# Altium schematic sheet Hexa.SchDoc: Title
size 594 x 420 mm; CompanyName: Лаборатория беспилотных систем; Address1: Address1; Address2: Address2; Address3: Address3; Address4: Address4; DocumentNumber: АБВГ.123456.001 Э3; SheetNumber: 1; SheetTotal: 2; Scale: -; DocumentType: Схема электрическая принципиальная; FirstReferrence: АБВГ.123456.001
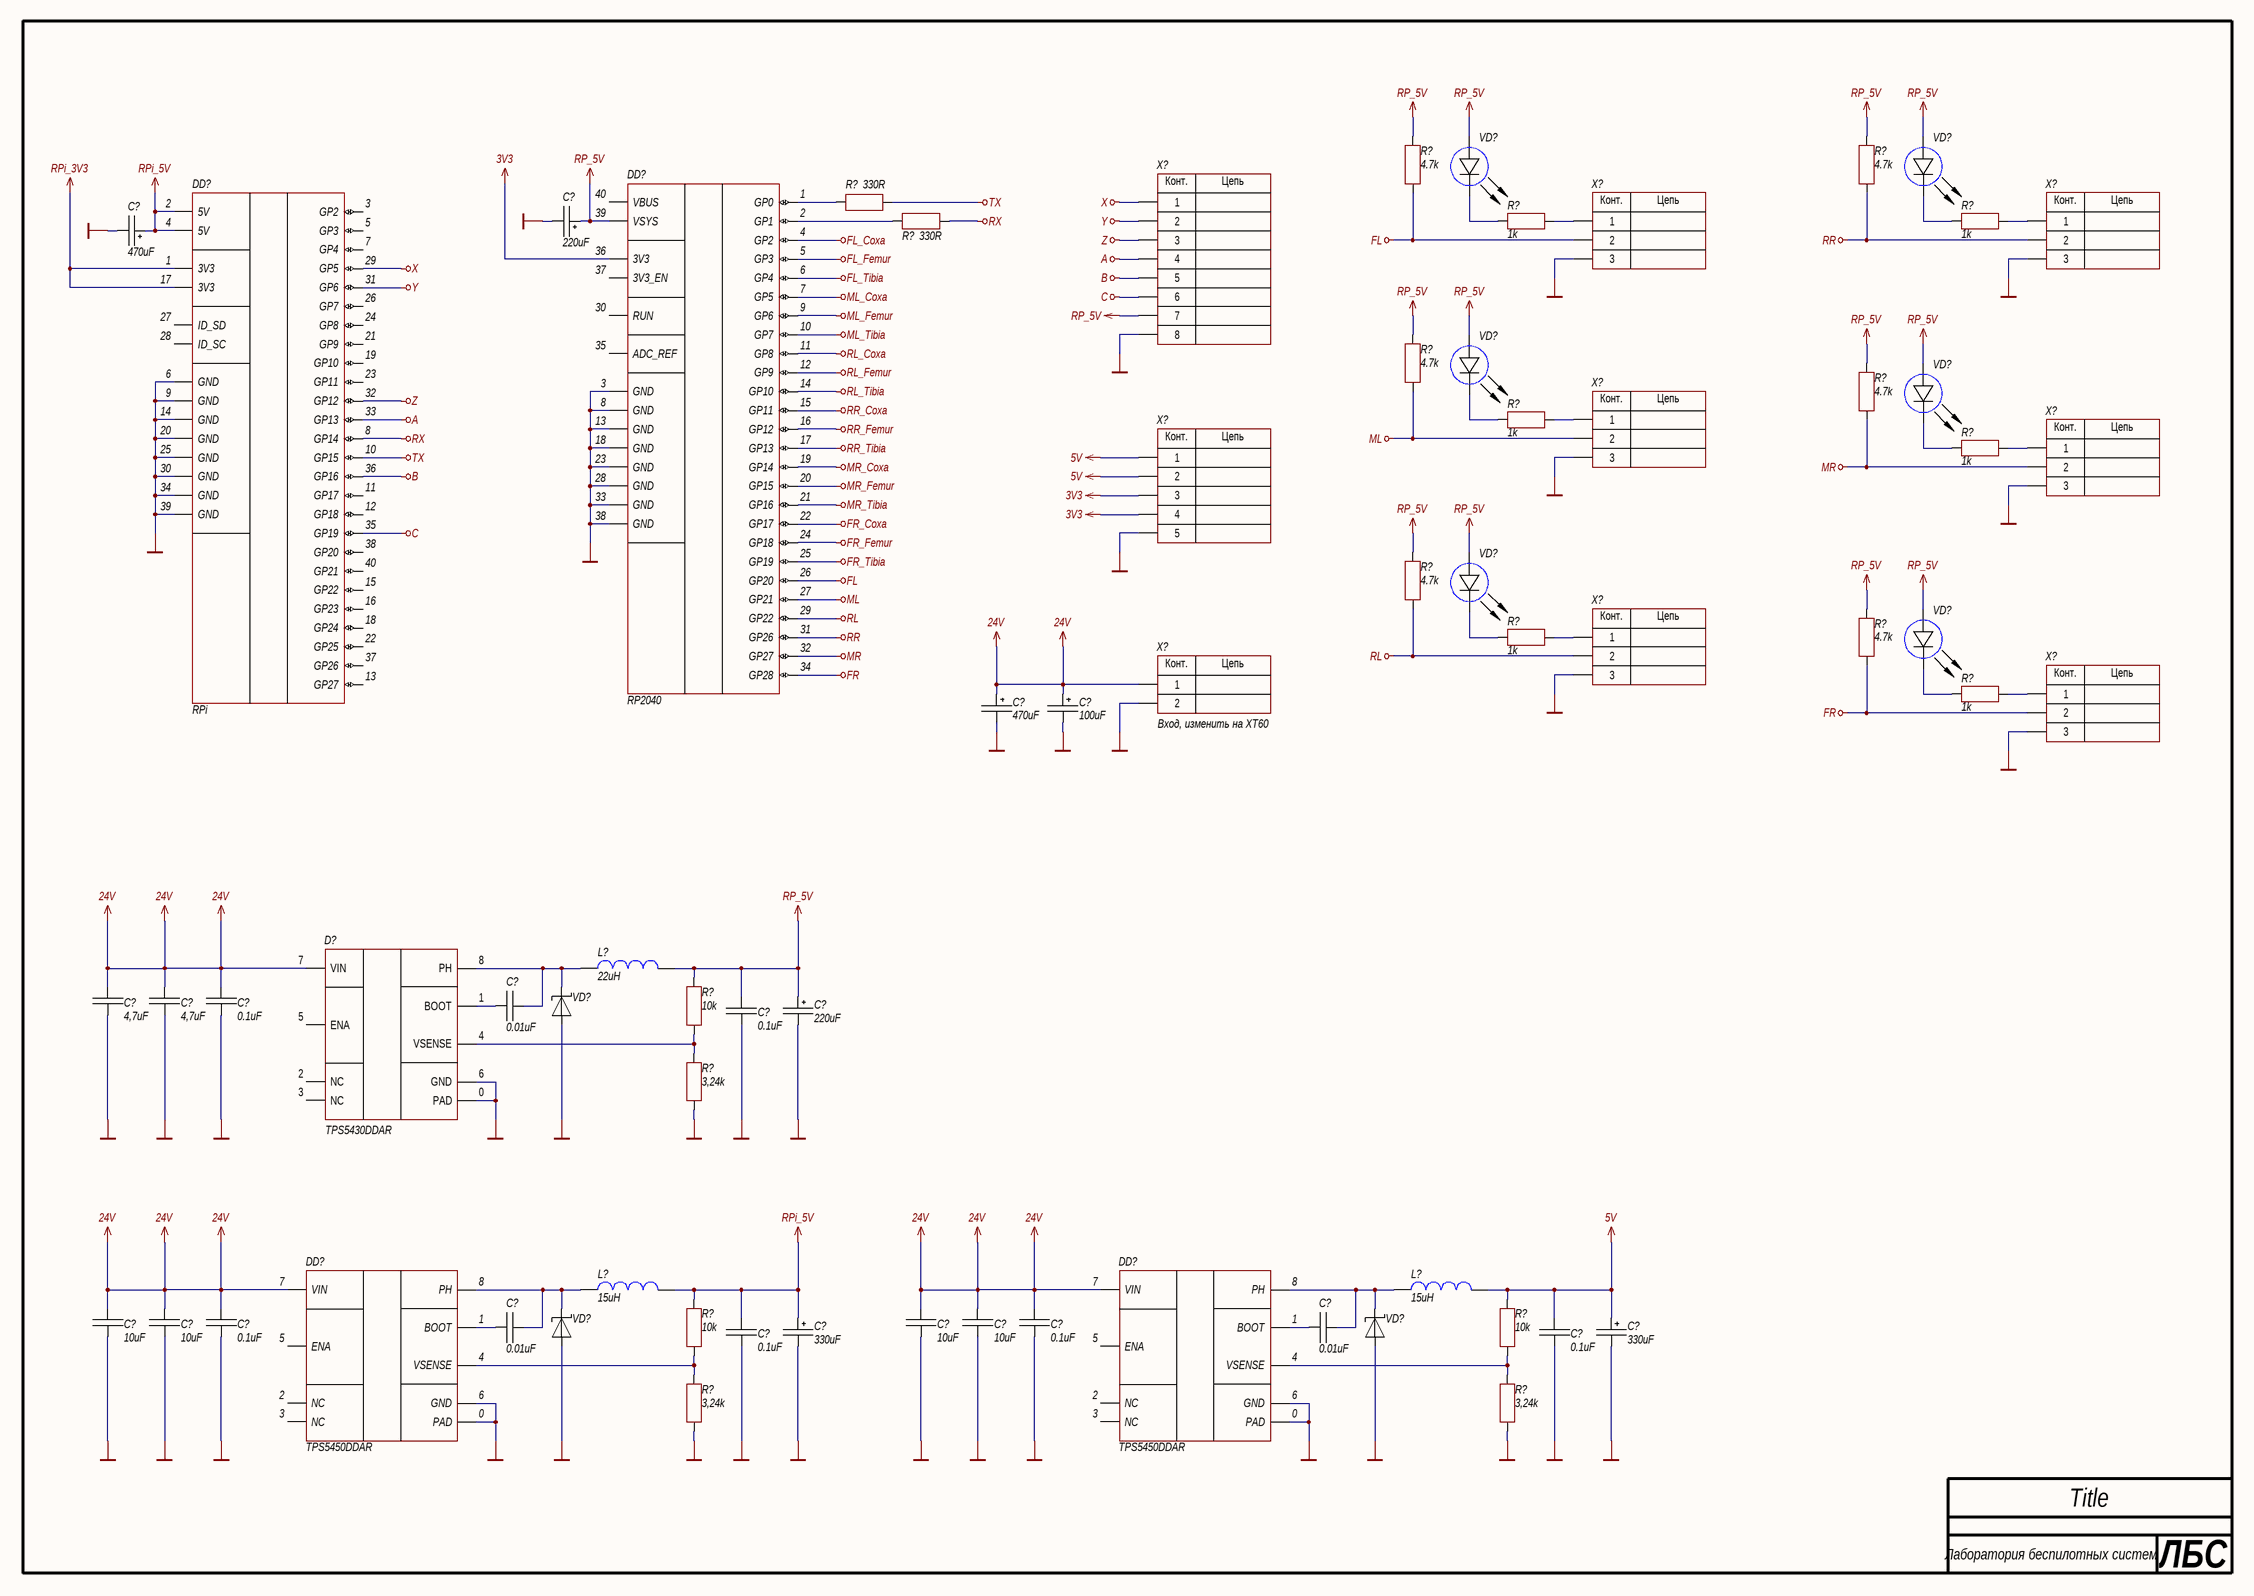
[diagram p0: Hexa.SchDoc]

## Parts
(Parts that share a designator on the sheet are numbered #1, #2 ... from top to bottom, then left to right.)
C?#1  value 220uF  [CAP: SMD_L7.3-W4.3-H1.9]
C?#2  value 470uF  [CAP: SMD_L7.3-W4.3-H1.9]
C?#3  value 470uF  [CAP: SMD_L7.3-W4.3-H1.9]
C?#4  value 100uF  [CAP: SMD_L7.3-W4.3-H1.9]
C?#5  value 4,7uF  [CAP: 1206]
C?#6  value 4,7uF  [CAP: 1206]
C?#7  value 0.1uF  [CAP: 0603]
C?#8  value 220uF  [CAP: SMD_L7.3-W4.3-H1.9]
C?#9  value 0.01uF  [CAP: 0603]
C?#10  value 0.1uF  [CAP: 0603]
C?#11  value 10uF  [CAP: 1206]
C?#12  value 10uF  [CAP: 1206]
C?#13  value 0.1uF  [CAP: 0603]
C?#14  value 10uF  [CAP: 1206]
C?#15  value 10uF  [CAP: 1206]
C?#16  value 0.1uF  [CAP: 0603]
C?#17  value 330uF  [CAP: SMD_L7.3-W4.3-H1.9]
C?#18  value 330uF  [CAP: SMD_L7.3-W4.3-H1.9]
C?#19  value 0.01uF  [CAP: 0603]
C?#20  value 0.01uF  [CAP: 0603]
C?#21  value 0.1uF  [CAP: 0603]
C?#22  value 0.1uF  [CAP: 0603]
D?  (no value)  [8-SOIC-PAD]
DD?#1  RP2040
DD?#2  RPi
DD?#3  TPS5450DDAR
DD?#4  TPS5450DDAR
L?#1  value 22uH  [IND: SMD_L2.5-W2.0]
L?#2  value 15uH  [IND: SMD_L2.5-W2.0]
L?#3  value 15uH  [IND: SMD_L2.5-W2.0]
R?#1  value 4.7k  [RES: 0603]
R?#2  value 4.7k  [RES: 0603]
R?#3  value 330R  [RES: 0603]
R?#4  value 330R  [RES: 0603]
R?#5  value 1k  [RES: 0603]
R?#6  value 1k  [RES: 0603]
R?#7  value 4.7k  [RES: 0603]
R?#8  value 4.7k  [RES: 0603]
R?#9  value 1k  [RES: 0603]
R?#10  value 1k  [RES: 0603]
R?#11  value 4.7k  [RES: 0603]
R?#12  value 4.7k  [RES: 0603]
R?#13  value 1k  [RES: 0603]
R?#14  value 1k  [RES: 0603]
R?#15  value 10k  [RES: 0603]
R?#16  value 3,24k  [RES: 0603]
R?#17  value 10k  [RES: 0603]
R?#18  value 10k  [RES: 0603]
R?#19  value 3,24k  [RES: 0603]
R?#20  value 3,24k  [RES: 0603]
VD?#1  (no value)  [LED: 0402B]
VD?#2  (no value)  [LED: 0402B]
VD?#3  (no value)  [LED: 0402B]
VD?#4  (no value)  [LED: 0402B]
VD?#5  (no value)  [LED: 0402B]
VD?#6  (no value)  [LED: 0402B]
VD?#7  (no value)  [DIODE: SMA]
VD?#8  (no value)  [DIODE: SMA]
VD?#9  (no value)  [DIODE: SMA]
X?#1  (no value)  [CON: PLS-8]
X?#2  (no value)  [CON: PLS-3]
X?#3  (no value)  [CON: PLS-3]
X?#4  (no value)  [CON: PLS-3]
X?#5  (no value)  [CON: PLS-3]
X?#6  (no value)  [CON: PLS-5]
X?#7  (no value)  [CON: PLS-3]
X?#8  (no value)  [CON: PLS-2]
X?#9  (no value)  [CON: PLS-3]

## Nets
3V3: DD?#1.36(3V3) X?#6.3 X?#6.4
5V: C?#18.1 C?#22.1 L?#3.1 R?#18.2 X?#6.1 X?#6.2
24V: C?#3.1 C?#4.1 C?#5.2 C?#6.2 C?#7.2 C?#11.2 C?#12.2 C?#13.2 C?#14.2 C?#15.2 C?#16.2 D?.7(VIN) DD?#3.7(VIN) DD?#4.7(VIN) X?#8.1
A: DD?#2.33(GP13) X?#1.4
B: DD?#2.36(GP16) X?#1.5
C: DD?#2.35(GP19) X?#1.6
FL: DD?#1.26(GP20) R?#1.2 X?#2.2
FL_Coxa: DD?#1.4(GP2)
FL_Femur: DD?#1.5(GP3)
FL_Tibia: DD?#1.6(GP4)
FR: DD?#1.34(GP28) R?#12.2 X?#9.2
FR_Coxa: DD?#1.22(GP17)
FR_Femur: DD?#1.24(GP18)
FR_Tibia: DD?#1.25(GP19)
GND: C?#1.2 C?#2.2 C?#3.2 C?#4.2 C?#5.1 C?#6.1 C?#7.1 C?#8.2 C?#10.2 C?#11.1 C?#12.1 C?#13.1 C?#14.1 C?#15.1 C?#16.1 C?#17.2 C?#18.2 C?#21.2 C?#22.2 D?.0(PAD) D?.6(GND) DD?#1.3(GND) DD?#1.8(GND) DD?#1.13(GND) DD?#1.18(GND) DD?#1.23(GND) DD?#1.28(GND) DD?#1.33(GND) DD?#1.38(GND) DD?#2.6(GND) DD?#2.9(GND) DD?#2.14(GND) DD?#2.20(GND) DD?#2.25(GND) DD?#2.30(GND) DD?#2.34(GND) DD?#2.39(GND) DD?#3.0(PAD) DD?#3.6(GND) DD?#4.0(PAD) DD?#4.6(GND) R?#16.1 R?#19.1 R?#20.1 VD?#7.1 VD?#8.1 VD?#9.1 X?#1.8 X?#2.3 X?#3.3 X?#4.3 X?#5.3 X?#6.5 X?#7.3 X?#8.2 X?#9.3
ML: DD?#1.27(GP21) R?#7.2 X?#4.2
ML_Coxa: DD?#1.7(GP5)
ML_Femur: DD?#1.9(GP6)
ML_Tibia: DD?#1.10(GP7)
MR: DD?#1.32(GP27) R?#8.2 X?#5.2
MR_Coxa: DD?#1.19(GP14)
MR_Femur: DD?#1.20(GP15)
MR_Tibia: DD?#1.21(GP16)
RL: DD?#1.29(GP22) R?#11.2 X?#7.2
RL_Coxa: DD?#1.11(GP8)
RL_Femur: DD?#1.12(GP9)
RL_Tibia: DD?#1.14(GP10)
RP_5V: C?#1.1 C?#8.1 C?#10.1 DD?#1.39(VSYS) L?#1.1 R?#1.1 R?#2.1 R?#7.1 R?#8.1 R?#11.1 R?#12.1 R?#15.2 VD?#1.1(A) VD?#2.1(A) VD?#3.1(A) VD?#4.1(A) VD?#5.1(A) VD?#6.1(A) X?#1.7
RPi_3V3: DD?#2.1(3V3) DD?#2.17(3V3)
RPi_5V: C?#2.1 C?#17.1 C?#21.1 DD?#2.2(5V) DD?#2.4(5V) L?#2.1 R?#17.2
RR: DD?#1.31(GP26) R?#2.2 X?#3.2
RR_Coxa: DD?#1.15(GP11)
RR_Femur: DD?#1.16(GP12)
RR_Tibia: DD?#1.17(GP13)
RX: DD?#2.8(GP14) R?#4.2
TX: DD?#2.10(GP15) R?#3.2
X: DD?#2.29(GP5) X?#1.1
Y: DD?#2.31(GP6) X?#1.2
Z: DD?#2.32(GP12) X?#1.3
NetC?#9_1: C?#9.1 D?.8(PH) L?#1.2 VD?#7.2
NetC?#9_2: C?#9.2 D?.1(BOOT)
NetC?#19_1: C?#19.1 DD?#3.8(PH) L?#2.2 VD?#8.2
NetC?#19_2: C?#19.2 DD?#3.1(BOOT)
NetC?#20_1: C?#20.1 DD?#4.8(PH) L?#3.2 VD?#9.2
NetC?#20_2: C?#20.2 DD?#4.1(BOOT)
NetD?_4: D?.4(VSENSE) R?#15.1 R?#16.2
NetDD?#1_1: DD?#1.1(GP0) R?#3.1
NetDD?#1_2: DD?#1.2(GP1) R?#4.1
NetDD?#3_4: DD?#3.4(VSENSE) R?#17.1 R?#19.2
NetDD?#4_4: DD?#4.4(VSENSE) R?#18.1 R?#20.2
NetR?#5_1: R?#5.1 VD?#1.2(C)
NetR?#5_2: R?#5.2 X?#2.1
NetR?#6_1: R?#6.1 VD?#2.2(C)
NetR?#6_2: R?#6.2 X?#3.1
NetR?#9_1: R?#9.1 VD?#3.2(C)
NetR?#9_2: R?#9.2 X?#4.1
NetR?#10_1: R?#10.1 VD?#4.2(C)
NetR?#10_2: R?#10.2 X?#5.1
NetR?#13_1: R?#13.1 VD?#5.2(C)
NetR?#13_2: R?#13.2 X?#7.1
NetR?#14_1: R?#14.1 VD?#6.2(C)
NetR?#14_2: R?#14.2 X?#9.1

Not connected (* = marked no-connect by the designer): D? 2(NC) 3(NC) 5(ENA); DD?#1 30(RUN) 35(ADC_REF) 37(3V3_EN) 40(VBUS); DD?#2 3(GP2) 5(GP3) 7(GP4) 11(GP17) 12(GP18) 13(GP27) 15(GP22) 16(GP23) 18(GP24) 19(GP10) 21(GP9) 22(GP25) 23(GP11) 24(GP8) 26(GP7) 27(ID_SD) 28(ID_SC) 37(GP26) 38(GP20) 40(GP21); DD?#3 2(NC) 3(NC) 5(ENA); DD?#4 2(NC) 3(NC) 5(ENA)

## Notes on the sheet
- (near X?#8) Вход, изменить на XT60
- ЛБС
- (in symbol PLS-2) Конт.; Цепь
- (in symbol PLS-3) Конт.; Цепь
- (in symbol PLS-5) Конт.; Цепь
- (in symbol PLS-8) Конт.; Цепь

## Library data of the parts
C?#1 C?#8 = Polymer_7.3x4.3x1.9: Manufacturer: Ymin; PartNumber: MPD220M1VD19040R; ValueManufacturerPartNumber: Polymer Cap, 220uF, 35V, ±20%, 40mOhm@100kHz, SMD,7.3x4.3х1.9mm, -55...+125°C; Impedance: 40mOhm@100kHz; Tolerance: ±20%; TypeCapacitor: Polymer Cap; Voltage: 35V; Package: SMD,7.3x4.3х1.9mm; HelpURL: https://jlcpcb.com/partdetail/Ymin-MPD220M1VD19040R/C2997487; Temperature: -55...+125°C; TypeDielectric: Polymer; SupplierCode: C2997487
C?#2 C?#3 = Polymer_7.3x4.3x1.9: Manufacturer: Ymin; PartNumber: MPD220M1VD19040R; ValueManufacturerPartNumber: Polymer Cap, 470uF, 35V, ±20%, 40mOhm@100kHz, SMD,7.3x4.3х1.9mm, -55...+125°C; Impedance: 40mOhm@100kHz; Tolerance: ±20%; TypeCapacitor: Polymer Cap; Voltage: 35V; Package: SMD,7.3x4.3х1.9mm; HelpURL: https://jlcpcb.com/partdetail/Ymin-MPD220M1VD19040R/C2997487; Temperature: -55...+125°C; TypeDielectric: Polymer; SupplierCode: C2997487
C?#4 = Polymer_7.3x4.3x1.9: Manufacturer: Ymin; PartNumber: MPD220M1VD19040R; ValueManufacturerPartNumber: Polymer Cap, 100uF, 35V, ±20%, 40mOhm@100kHz, SMD,7.3x4.3х1.9mm, -55...+125°C; Impedance: 40mOhm@100kHz; Tolerance: ±20%; TypeCapacitor: Polymer Cap; Voltage: 35V; Package: SMD,7.3x4.3х1.9mm; HelpURL: https://jlcpcb.com/partdetail/Ymin-MPD220M1VD19040R/C2997487; Temperature: -55...+125°C; TypeDielectric: Polymer; SupplierCode: C2997487
C?#5 C?#6 = Ceramic_1206: Manufacturer: Yageo; PartNumber: CC1206KRX7R9BB104; ValueManufacturerPartNumber: Ceramic capacitor, 4,7uF, X7R, ±10%, 50V, 1206, -55...+125°C; TypeCapacitor: Ceramic capacitor; Tolerance: ±10%; TypeDielectric: X7R; Voltage: 50V; Package: 1206; HelpURL: https://www.digikey.com/product-detail/en/yageo/CC1206KRX7R9BB104/311-1179-1-ND/303089; Temperature: -55...+125°C
C?#7 C?#10 C?#13 C?#16 C?#21 C?#22 = Ceramic_0603: Manufacturer: Yageo; PartNumber: CC0603KRX7R7BB104; ValueManufacturerPartNumber: Ceramic capacitor, 0.1uF, X7R, ±10%, 16V, 0603, -55...+125°C; TypeCapacitor: Ceramic capacitor; Tolerance: ±10%; TypeDielectric: X7R; Voltage: 16V; Package: 0603; HelpURL: https://www.digikey.com/product-detail/en/yageo/CC0603KRX7R7BB104/311-1088-1-ND/302998; Temperature: -55...+125°C
C?#9 C?#19 C?#20 = Ceramic_0603: Manufacturer: Yageo; PartNumber: CC0603KRX7R7BB104; ValueManufacturerPartNumber: Ceramic capacitor, 0.01uF, X7R, ±10%, 16V, 0603, -55...+125°C; TypeCapacitor: Ceramic capacitor; Tolerance: ±10%; TypeDielectric: X7R; Voltage: 16V; Package: 0603; HelpURL: https://www.digikey.com/product-detail/en/yageo/CC0603KRX7R7BB104/311-1088-1-ND/302998; Temperature: -55...+125°C
C?#11 C?#12 C?#14 C?#15 = Ceramic_1206: Manufacturer: Yageo; PartNumber: CC1206KRX7R9BB104; ValueManufacturerPartNumber: Ceramic capacitor, 10uF, X7R, ±10%, 50V, 1206, -55...+125°C; TypeCapacitor: Ceramic capacitor; Tolerance: ±10%; TypeDielectric: X7R; Voltage: 50V; Package: 1206; HelpURL: https://www.digikey.com/product-detail/en/yageo/CC1206KRX7R9BB104/311-1179-1-ND/303089; Temperature: -55...+125°C
C?#17 C?#18 = Polymer_7.3x4.3x1.9: Manufacturer: Ymin; PartNumber: MPD220M1VD19040R; ValueManufacturerPartNumber: Polymer Cap, 330uF, 35V, ±20%, 40mOhm@100kHz, SMD,7.3x4.3х1.9mm, -55...+125°C; Impedance: 40mOhm@100kHz; Tolerance: ±20%; TypeCapacitor: Polymer Cap; Voltage: 35V; Package: SMD,7.3x4.3х1.9mm; HelpURL: https://jlcpcb.com/partdetail/Ymin-MPD220M1VD19040R/C2997487; Temperature: -55...+125°C; TypeDielectric: Polymer; SupplierCode: C2997487
D? = TPS5430DDAR: Buck converter; Manufacturer: Texas Intruments; ValueManufacturerPartNumber: DC/DC buck converter, input 4.5...36V, 500KHz, 1.221V-32.04V, 3A, -40...+125°C, 8-SOIC; VoltageInput: input 4.5...36V; Frequency: 500KHz; CurrentOutput: 3A; VoltageOutput: 1.221V-32.04V; HelpURL: https://jlcpcb.com/partdetail/TexasInstruments-TPS5430DDAR/C9864; Package: 8-SOIC; ComponentType: DC/DC buck converter; Temperature: -40...+125°C; SupplierCode: *; PartNumber: TPS5430DDAR
L?#1-L?#3 = Inductor_FTC252010S220MBCA: Manufacturer: Sunlord; TypeInductor: Fixed inductor; MaxCurrent: 1.1A; Tolerance: ±20%; PartNumber: FTC252010S220MBCA; Package: SMD,2x2.5mm; HelpURL: https://jlcpcb.com/partdetail/6763511-FTC252010S220MBCA/C5832391; ValueManufacturerPartNumber: =TypeInductor+', '+Value+', '+Tolerance+', '+Package+', '+MaxCurrent+', '+Temperature; SupplierCode: C5832391
R?#1 R?#2 R?#7 R?#8 R?#11 R?#12 = Resistor_0603: Manufacturer: Yageo; PartNumber: RC0603JR-07100RL; ValueManufacturerPartNumber: Resistor film, 4.7k, ±5%, 0603, 0.1W, -55...+125°C; TypeResistor: Resistor film; Power: 0.1W; Tolerance: ±5%; Package: 0603; HelpURL: https://www.digikey.com/product-detail/en/yageo/RC0603JR-07100RL/311-100GRCT-ND/729644; Temperature: -55...+125°C
R?#3 R?#4 = Resistor_0603: Manufacturer: Yageo; PartNumber: RC0603JR-07100RL; ValueManufacturerPartNumber: Resistor film, 330R, ±5%, 0603, 0.1W, -55...+125°C; TypeResistor: Resistor film; Power: 0.1W; Tolerance: ±5%; Package: 0603; HelpURL: https://www.digikey.com/product-detail/en/yageo/RC0603JR-07100RL/311-100GRCT-ND/729644; Temperature: -55...+125°C
R?#5 R?#6 R?#9 R?#10 R?#13 R?#14 = Resistor_0603: Manufacturer: Yageo; PartNumber: RC0603JR-07100RL; ValueManufacturerPartNumber: Resistor film, 1k, ±5%, 0603, 0.1W, -55...+125°C; TypeResistor: Resistor film; Power: 0.1W; Tolerance: ±5%; Package: 0603; HelpURL: https://www.digikey.com/product-detail/en/yageo/RC0603JR-07100RL/311-100GRCT-ND/729644; Temperature: -55...+125°C
R?#15 R?#17 R?#18 = Resistor_0603: Manufacturer: Yageo; PartNumber: RC0603JR-07100RL; ValueManufacturerPartNumber: Resistor film, 10k, ±5%, 0603, 0.1W, -55...+125°C; TypeResistor: Resistor film; Power: 0.1W; Tolerance: ±5%; Package: 0603; HelpURL: https://www.digikey.com/product-detail/en/yageo/RC0603JR-07100RL/311-100GRCT-ND/729644; Temperature: -55...+125°C
R?#16 R?#19 R?#20 = Resistor_0603: Manufacturer: Yageo; PartNumber: RC0603JR-07100RL; ValueManufacturerPartNumber: Resistor film, 3,24k, ±5%, 0603, 0.1W, -55...+125°C; TypeResistor: Resistor film; Power: 0.1W; Tolerance: ±5%; Package: 0603; HelpURL: https://www.digikey.com/product-detail/en/yageo/RC0603JR-07100RL/311-100GRCT-ND/729644; Temperature: -55...+125°C
VD?#1-VD?#6 = LED_single: ValueManufacturerPartNumber: LED, Green, *, *, *, -55...+150°C; TypeDiode: LED; ColorParameter: Green; Manufacturer: *; Package: *; HelpURL: *; Temperature: -55...+150°C; Current: *; VoltageDrop: *; PartNumber: *; Color: GREEN
VD?#7-VD?#9 = Schottky_single: Manufacturer: Diodes Incorporated; ValueManufacturerPartNumber: Schottky diode, 80V, 500mA, 1V, 15pF, SOD-123, -55...+150°C; PartNumber: MBR0580S1-7; TypeDiode: Schottky diode; Voltage: 80V; Current: 500mA; VoltageDrop: 1V; RecoveryTime: 15pF; Package: SOD-123; HelpURL: https://www.digikey.com/product-detail/en/diodes-incorporated/MBR0580S1-7/MBR0580S1-7DICT-ND/5080371; Temperature: -55...+150°C
X?#1 = PLS-8: Manufacturer: Connfly; ValueManufacturerPartNumber: Connector, 8pin, 2.54mm, 500VAC, 3A; TypeConnector: Connector; Voltage: 500VAC; Pitch: 2.54mm; Current: 3A; Multichannel: 8pin; HelpURL: https://www.chipdip.ru/product/pls-8-ds1021-1-8sf112; PartNumber: PLS-8
X?#2-X?#5 X?#7 X?#9 = PLS-3: Manufacturer: Connfly; ValueManufacturerPartNumber: Connector, 3pin, 2.54mm, 500VAC, 3A; TypeConnector: Connector; Voltage: 500VAC; Pitch: 2.54mm; Current: 3A; Multichannel: 3pin; HelpURL: https://www.chipdip.ru/product/pls-3; PartNumber: PLS-3
X?#6 = PLS-5: Manufacturer: Connfly; ValueManufacturerPartNumber: Connector, 5pin, 2.54mm, 500VAC, 3A; TypeConnector: Connector; Voltage: 500VAC; Pitch: 2.54mm; Current: 3A; Multichannel: 5pin; HelpURL: https://www.chipdip.ru/product/pls-5; PartNumber: PLS-5
X?#8 = PLS-2: Manufacturer: Connfly; ValueManufacturerPartNumber: Connector, 2pin, 2.54mm, 500VAC, 3A; TypeConnector: Connector; Voltage: 500VAC; Pitch: 2.54mm; Current: 3A; Multichannel: 2pin; HelpURL: https://www.chipdip.ru/product/pls-2; PartNumber: PLS-2